# EAGLE design QuadLFO-Dev (EAGLE 9.2.1)

## Sheet 1 of 4: ATMEGA328P
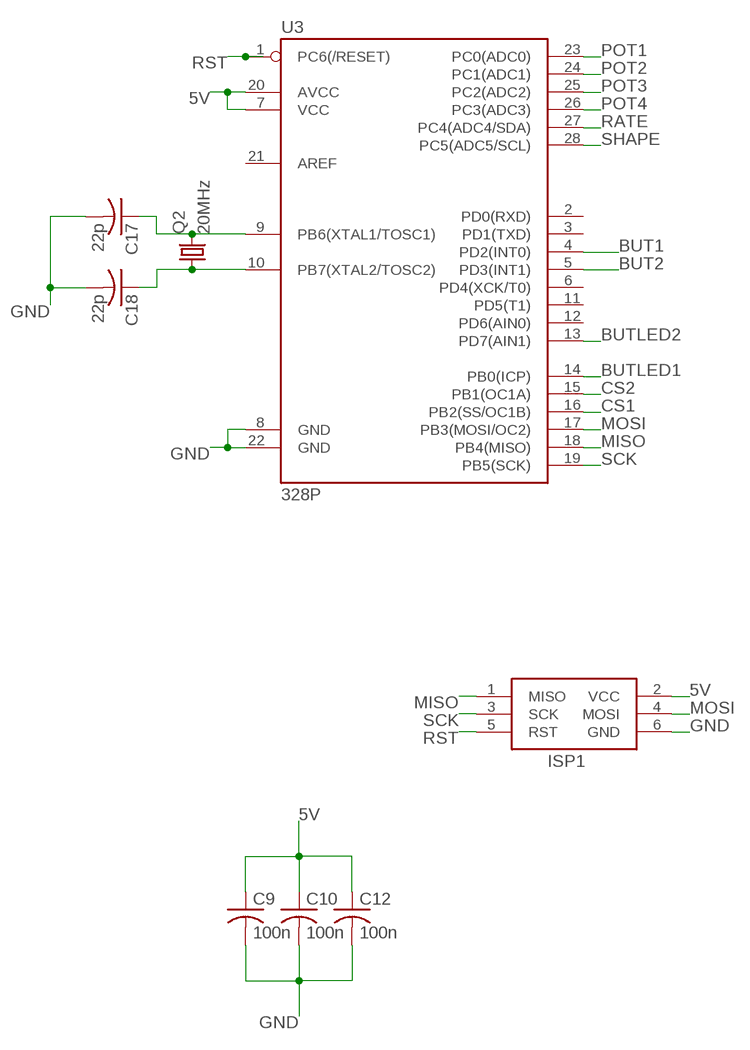
[diagram p0: schematic, sheet 1]

### Parts
C9  100n  C-USC0805K  [C0805K]
C10  100n  C-USC0805K  [C0805K]
C12  100n  C-USC0805K  [C0805K]
C17  22p  C-USC0805K  [C0805K]
C18  22p  C-USC0805K  [C0805K]
ISP1  AVRISP-6  [AVRISP]
Q2  20MHz  CRYSTALHC49UP  [HC49UP]
U3  328P  ATMEGA328P_PDIP  [DIP28]

### Nets
5V [Power]: C9.1 C10.1 C12.1 ISP1.2(VCC) U3.7(VCC) U3.20(AVCC) ; also sheet 2,3,4
BUT1: U3.4(PD2(INT0)) ; also sheet 4
BUT2: U3.5(PD3(INT1)) ; also sheet 4
BUTLED1: U3.14(PB0(ICP)) ; also sheet 4
BUTLED2: U3.13(PD7(AIN1)) ; also sheet 4
CS1: U3.16(PB2(SS/OC1B)) ; also sheet 3
CS2: U3.15(PB1(OC1A)) ; also sheet 3
GND [Power]: C9.2 C10.2 C12.2 C17.2 C18.2 ISP1.6(GND) U3.8(GND) U3.22(GND) ; also sheet 2,3,4
MISO: ISP1.1(MISO) U3.18(PB4(MISO))
MOSI: ISP1.4(MOSI) U3.17(PB3(MOSI/OC2)) ; also sheet 3
N$10: C17.1 Q2.2 U3.9(PB6(XTAL1/TOSC1))
N$11: C18.1 Q2.1 U3.10(PB7(XTAL2/TOSC2))
POT1: U3.23(PC0(ADC0)) ; also sheet 4
POT2: U3.24(PC1(ADC1)) ; also sheet 4
POT3: U3.25(PC2(ADC2)) ; also sheet 4
POT4: U3.26(PC3(ADC3)) ; also sheet 4
RATE: U3.27(PC4(ADC4/SDA)) ; also sheet 4
RST: ISP1.5(RST) U3.1(PC6(/RESET))
SCK: ISP1.3(SCK) U3.19(PB5(SCK)) ; also sheet 3
SHAPE: U3.28(PC5(ADC5/SCL)) ; also sheet 4
Unconnected: U3.2(PD0(RXD)) U3.3(PD1(TXD)) U3.6(PD4(XCK/T0)) U3.11(PD5(T1)) U3.12(PD6(AIN0)) U3.21(AREF)

## Sheet 2 of 4: Power
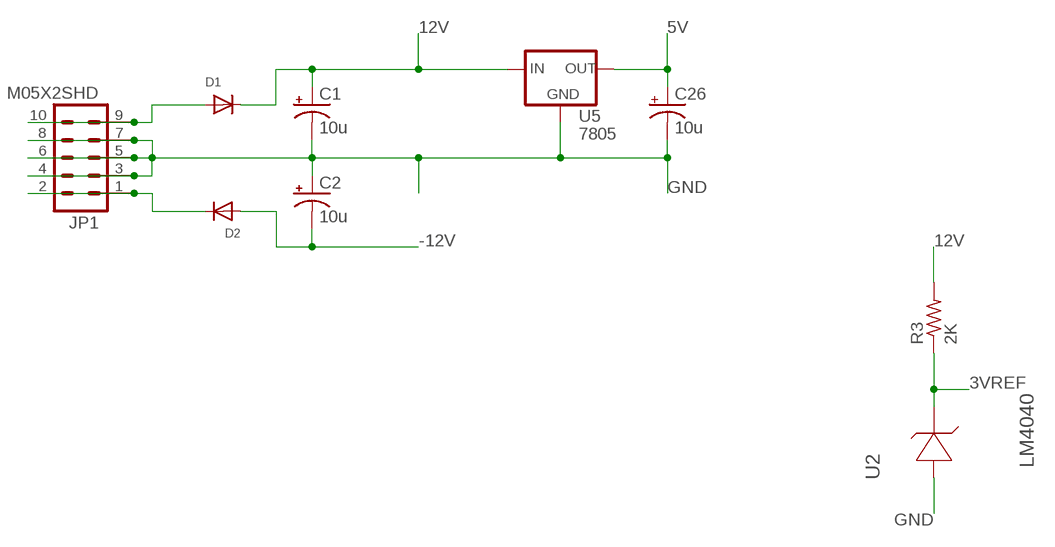
[diagram p1: schematic, sheet 2]

### Parts
C1  10u  CPOL-US153CLV-0505  [153CLV-0505]
C2  10u  CPOL-US153CLV-0505  [153CLV-0505]
C26  10u  CPOL-US153CLV-0505  [153CLV-0505]
D1  DIODESMA  [SMADIODE]
D2  DIODESMA  [SMADIODE]
JP1  M05X2SHD  [2X5-SHROUDED]
R3  2K  R-US_R0805  [R0805]
U2  LM4040  LM4040A30IDBZT  [SOT95P237X112-3N]
U5  7805  V-REG  [V-REG]

### Nets
3VREF: R3.1 U2.1(CATHODE) ; also sheet 3
5V [Power]: C26.+ U5.3(OUT) ; also sheet 1,3,4
12V: C1.+ D1.C R3.2 U5.1(IN) ; also sheet 3
-12V: C2.- D2.A ; also sheet 3
GND [Power]: C1.- C2.+ C26.- JP1.3 JP1.4 JP1.5 JP1.6 JP1.7 JP1.8 U2.2(ANODE) U5.4(GND) ; also sheet 1,3,4
N$2: D2.C JP1.1 JP1.2
N$9: D1.A JP1.9 JP1.10
Unconnected: U2.3(NC)

## Sheet 3 of 4: CV Out
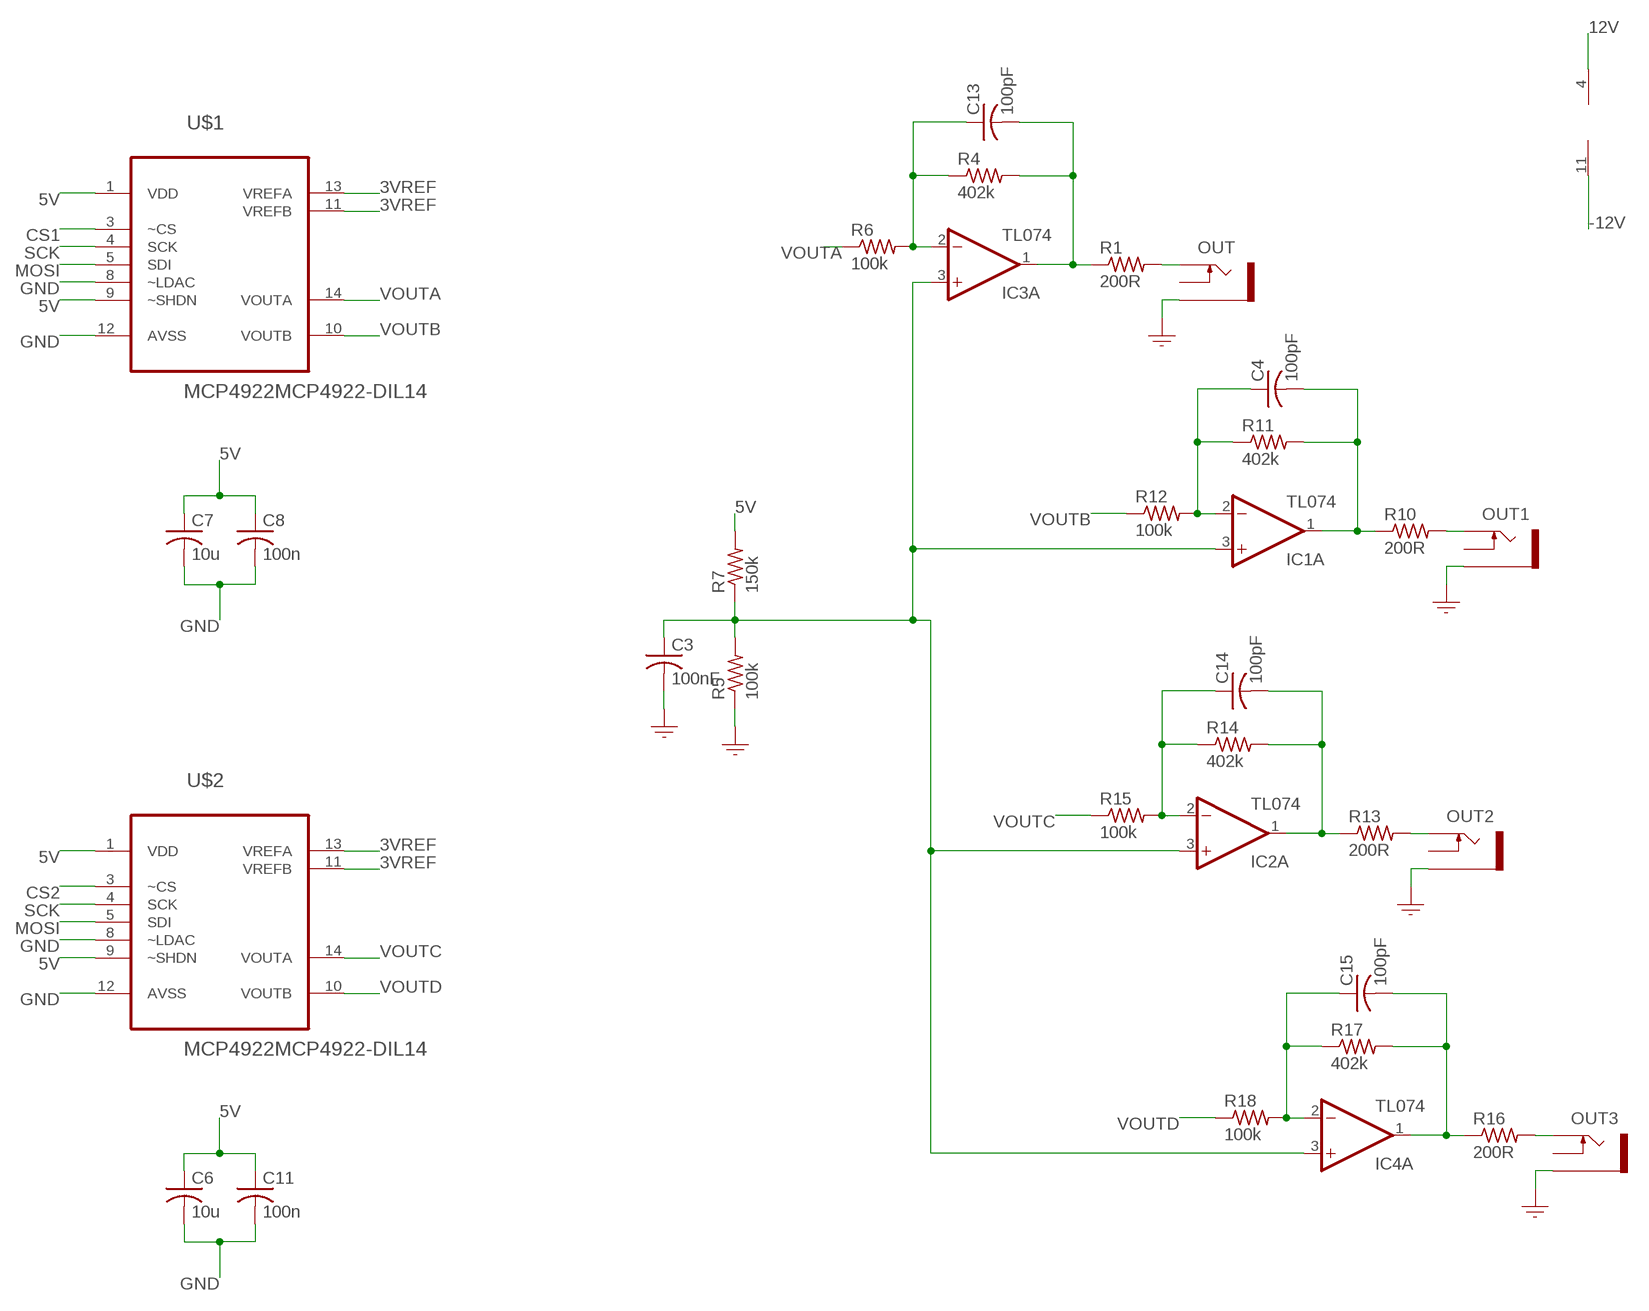
[diagram p2: schematic, sheet 3]

### Parts
C3  100nF  CAPACITOR-USC0805  [C0805]
C4  100pF  CAPACITOR-USC0805  [C0805]
C6  10u  C-USC0805K  [C0805K]
C7  10u  C-USC0805K  [C0805K]
C8  100n  C-USC0805K  [C0805K]
C11  100n  C-USC0805K  [C0805K]
C13  100pF  CAPACITOR-USC0805  [C0805]
C14  100pF  CAPACITOR-USC0805  [C0805]
C15  100pF  CAPACITOR-USC0805  [C0805]
IC1  TL074  OPAMP_QUADD  [SO14]
IC2  TL074  OPAMP_QUADD  [SO14]
IC3  TL074  OPAMP_QUADD  [SO14]
IC4  TL074  OPAMP_QUADD  [SO14]
OUT  PJ301M-12  SOCKET_MONO_3.5MMPJ301M-12  [PJ301M-12]
OUT1  PJ301M-12  SOCKET_MONO_3.5MMPJ301M-12  [PJ301M-12]
OUT2  PJ301M-12  SOCKET_MONO_3.5MMPJ301M-12  [PJ301M-12]
OUT3  PJ301M-12  SOCKET_MONO_3.5MMPJ301M-12  [PJ301M-12]
R1  200R  RESISTOR_USR0805  [R0805]
R4  402k  RESISTOR_USR0805  [R0805]
R5  100k  RESISTOR_USR0805  [R0805]
R6  100k  RESISTOR_USR0805  [R0805]
R7  150k  RESISTOR_USR0805  [R0805]
R10  200R  RESISTOR_USR0805  [R0805]
R11  402k  RESISTOR_USR0805  [R0805]
R12  100k  RESISTOR_USR0805  [R0805]
R13  200R  RESISTOR_USR0805  [R0805]
R14  402k  RESISTOR_USR0805  [R0805]
R15  100k  RESISTOR_USR0805  [R0805]
R16  200R  RESISTOR_USR0805  [R0805]
R17  402k  RESISTOR_USR0805  [R0805]
R18  100k  RESISTOR_USR0805  [R0805]
U$1  MCP4922MCP4922-DIL14  [DIL14]
U$2  MCP4922MCP4922-DIL14  [DIL14]

### Nets
3VREF: U$1.11(VREFB) U$1.13(VREFA) U$2.11(VREFB) U$2.13(VREFA) ; also sheet 2
5V [Power]: C6.1 C7.1 C8.1 C11.1 R7.2 U$1.1(VDD) U$1.9(~SHDN) U$2.1(VDD) U$2.9(~SHDN) ; also sheet 1,2,4
12V: IC1.4(P:V+) ; also sheet 2
-12V: IC1.11(P:V-) ; also sheet 2
CS1: U$1.3(~CS) ; also sheet 1
CS2: U$2.3(~CS) ; also sheet 1
GND [Power]: C3.2 C6.2 C7.2 C8.2 C11.2 OUT1.GND(SLEEVE) OUT2.GND(SLEEVE) OUT3.GND(SLEEVE) OUT.GND(SLEEVE) R5.1 U$1.8(~LDAC) U$1.12(AVSS) U$2.8(~LDAC) U$2.12(AVSS) ; also sheet 1,2,4
MOSI: U$1.5(SDI) U$2.5(SDI) ; also sheet 1
N$4: C13.2 IC3.1(A:OUT) R1.1 R4.2
N$5: OUT.TIP R1.2
N$12: C13.1 IC3.2(A:-IN) R4.1 R6.2
N$14: C4.2 IC1.1(A:OUT) R10.1 R11.2
N$15: OUT1.TIP R10.2
N$18: C4.1 IC1.2(A:-IN) R11.1 R12.2
N$19: C14.2 IC2.1(A:OUT) R13.1 R14.2
N$20: OUT2.TIP R13.2
N$23: C14.1 IC2.2(A:-IN) R14.1 R15.2
N$24: C15.2 IC4.1(A:OUT) R16.1 R17.2
N$26: OUT3.TIP R16.2
N$27: C3.1 IC1.3(A:+IN) IC2.3(A:+IN) IC3.3(A:+IN) IC4.3(A:+IN) R5.2 R7.1
N$29: C15.1 IC4.2(A:-IN) R17.1 R18.2
SCK: U$1.4(SCK) U$2.4(SCK) ; also sheet 1
VOUTA: R6.1 U$1.14(VOUTA)
VOUTB: R12.1 U$1.10(VOUTB)
VOUTC: R15.1 U$2.14(VOUTA)
VOUTD: R18.1 U$2.10(VOUTB)
Unconnected: IC1.5(B:+IN) IC1.6(B:-IN) IC1.7(B:OUT) IC1.8(C:OUT) IC1.9(C:-IN) IC1.10(C:+IN) IC1.12(D:+IN) IC1.13(D:-IN) IC1.14(D:OUT) IC2.5(B:+IN) IC2.6(B:-IN) IC2.7(B:OUT) IC2.8(C:OUT) IC2.9(C:-IN) IC2.10(C:+IN) IC2.12(D:+IN) IC2.13(D:-IN) IC2.14(D:OUT) IC3.5(B:+IN) IC3.6(B:-IN) IC3.7(B:OUT) IC3.8(C:OUT) IC3.9(C:-IN) IC3.10(C:+IN) IC3.12(D:+IN) IC3.13(D:-IN) IC3.14(D:OUT) IC4.5(B:+IN) IC4.6(B:-IN) IC4.7(B:OUT) IC4.8(C:OUT) IC4.9(C:-IN) IC4.10(C:+IN) IC4.12(D:+IN) IC4.13(D:-IN) IC4.14(D:OUT) OUT1.NORM(SWITCH) OUT2.NORM(SWITCH) OUT3.NORM(SWITCH) OUT.NORM(SWITCH)

## Sheet 4 of 4: Pots and Buttons
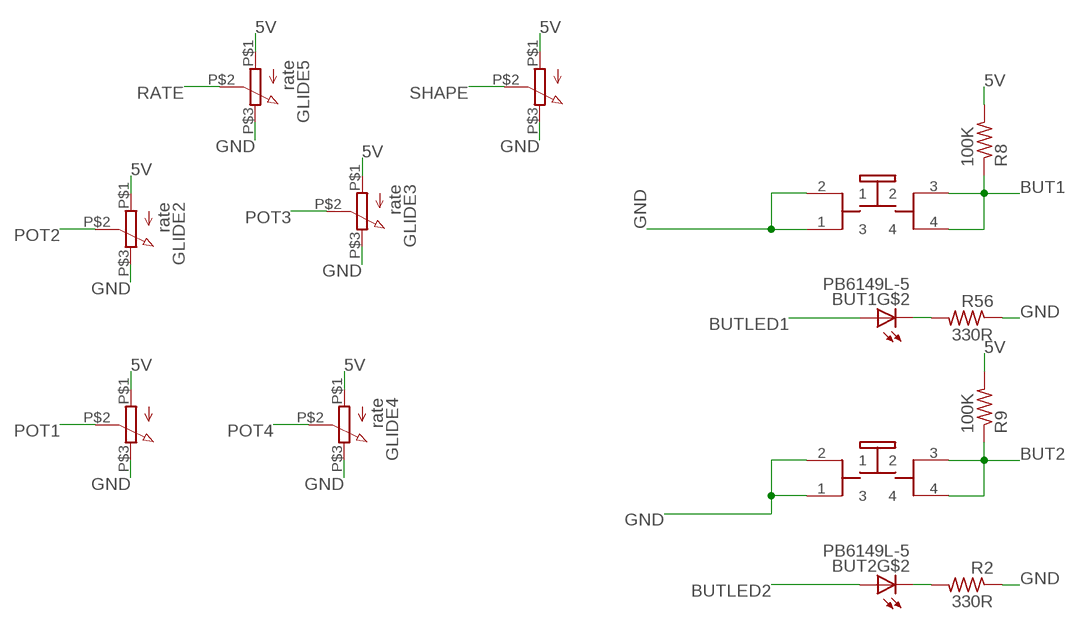
[diagram p3: schematic, sheet 4]

### Parts
BUT1  PB6149L-5  [PB6149L]
BUT2  PB6149L-5  [PB6149L]
GLIDE1  rate  9MMPOT  [POT]
GLIDE2  rate  9MMPOT  [POT]
GLIDE3  rate  9MMPOT  [POT]
GLIDE4  rate  9MMPOT  [POT]
GLIDE5  rate  9MMPOT  [POT]
GLIDE6  rate  9MMPOT  [POT]
R2  330R  R-US_R0805  [R0805]
R8  100K  R-US_R0805  [R0805]
R9  100K  R-US_R0805  [R0805]
R56  330R  R-US_R0805  [R0805]

### Nets
5V [Power]: GLIDE1.P$1 GLIDE2.P$1 GLIDE3.P$1 GLIDE4.P$1 GLIDE5.P$1 GLIDE6.P$1 R8.2 R9.2 ; also sheet 1,2,3
BUT1: BUT1.3 BUT1.4 R8.1 ; also sheet 1
BUT2: BUT2.3 BUT2.4 R9.1 ; also sheet 1
BUTLED1: BUT1.A ; also sheet 1
BUTLED2: BUT2.A ; also sheet 1
GND [Power]: BUT1.1 BUT1.2 BUT2.1 BUT2.2 GLIDE1.P$3 GLIDE2.P$3 GLIDE3.P$3 GLIDE4.P$3 GLIDE5.P$3 GLIDE6.P$3 R2.1 R56.1 ; also sheet 1,2,3
N$8: BUT2.K(C) R2.2
N$65: BUT1.K(C) R56.2
POT1: GLIDE1.P$2 ; also sheet 1
POT2: GLIDE2.P$2 ; also sheet 1
POT3: GLIDE3.P$2 ; also sheet 1
POT4: GLIDE4.P$2 ; also sheet 1
RATE: GLIDE5.P$2 ; also sheet 1
SHAPE: GLIDE6.P$2 ; also sheet 1

## Power pins joined to a net without a drawn wire
V+: IC2.4(P:V+) IC3.4(P:V+) IC4.4(P:V+)
V-: IC2.11(P:V-) IC3.11(P:V-) IC4.11(P:V-)

## Library data of the parts
BUT1 BUT2 = INSTRUO:PB6149L-5
C1 C2 C26 = rcl:CPOL-US: POLARIZED CAPACITOR, American symbol
C3 C4 C13-C15 = GMSN:CAPACITOR-US: Capacitor; SORT: 3
C6-C12 C17 C18 = rcl:C-US: CAPACITOR, American symbol
D1 D2 = adafruit:DIODE: Diode SMADIODE - SMA Surface Mount Package 20V 1A Schottky Diode Digikey: 641-1014-6-ND DO-1N4148 - Through Hole Small Current Diode SOD-123 20V 1 A (.5mV Vf) Schottky Diode - Digikey: MBRX120TPMSCT-ND SOD-323 10V 570mA (.38mV Vf, 3ns) Schottky Diode - Digikey: ZLLS410CT-ND SOD-523 30V 30mA Schottky Diode (RB751S-40TE61) - Digikey: RB751S-40TE61CT-ND SOT23-R/W - SOT23 Package (R = Solder Paste/Reflow Ovens, W = Hand-Soldering) BAT54Film 40V 300mA - Digikey: 497-7162-1-ND
GLIDE1-GLIDE6 = GMSN:9MMPOT
IC1-IC4 = GMSN:OPAMP_QUAD: OP AMP; SORT: 4
ISP1 = adafruit:AVRISP: AVR ISP HEADER Standard 6 pin header for AVR programming
JP1 = SparkFun-Connectors:M05X2: Header 5x2 Standard 10-pin dual row 0.1" header. Commonly used with AVR-ISP. Use with Spark Fun Electronics SKU: PRT-00778
OUT OUT1-OUT3 = GMSN:SOCKET_MONO_3.5MM: 3.5 mm Jack Socket; SORT: 8
Q2 = adafruit:CRYSTAL: CRYSTAL; OC_FARNELL: unknown; OC_NEWARK: unknown
R1 R4-R7 R10-R18 = GMSN:RESISTOR_US: Resistor; SORT: 2
R2 R3 R8 R9 R56 = rcl:R-US_: RESISTOR, American symbol
U2 = GMSN-R2Project:LM4040A30IDBZT: PRECISION MICROPOWER SHUNT VOLTAGE REFERENCE; MPN: LM4040A50IDBZT; OC_FARNELL: 1755108; OC_NEWARK: 58K5870; PACKAGE: 3-SOT-23; RS-NUMBER: 809-6352; SUPPLIER: TEXAS INSTRUMENTS
U3 = SparkFun-IC-Microcontroller:ATMEGA328P_PDIP: Atmel 328P Through hole ATMEGA328P uC used in the Arduino 32kb flash, 1k EEPROM, 2k SRAM Datasheet <http://www.sparkfun.com/datasheets/Components/SMD/ATMega328.pdf> SparkFun Products Storefront component: AVR 28 Pin 20MHz 32K 6A/D - ATMega328P <https://www.sparkfun.com/products/9061> (COM-09061) SparkFun Simon Says - Through-Hole Soldering Kit <https://www.sparkfun.com/products/10547> (KIT-10547) SparkFun Learn to Solder - Simon Says <https://www.sparkfun.com/products/13708> (KIT-13708) SparkFun BigTime Watch Kit <https://www.sparkfun.com/products/11734> (KIT-11734) SparkFun ClockIt <https://www.sparkfun.com/products/10930> (KIT-10930) SparkFun Serial Enabled LCD Kit <https://www.sparkfun.com/products/10097> (LCD-10097) SparkFun Simon Tilts - Through Hole Soldering Kit <https://www.sparkfun.com/products/12634> (KIT-12634) SparkFun Frequency Counter Kit <https://www.sparkfun.com/products/10140> (KIT-10140) FabFM Radio Kit <https://www.sparkfun.com/products/11043> (KIT-11043) SparkFun Binary Blaster Kit <https://www.sparkfun.com/products/12037> (KIT-12037) SparkFun Metro-Gnome <https://www.sparkfun.com/products/9236> (KIT-09236) ATmega328 with Arduino Optiboot (Uno) <https://www.sparkfun.com/products/10524> (DEV-10524); PROD_ID: IC-09136
U5 = INSTRUO:V-REG
U$1 U$2 = GMSN-R2Project:MCP4922

## Net classes
1 Power: width 0.8 mm

## Board
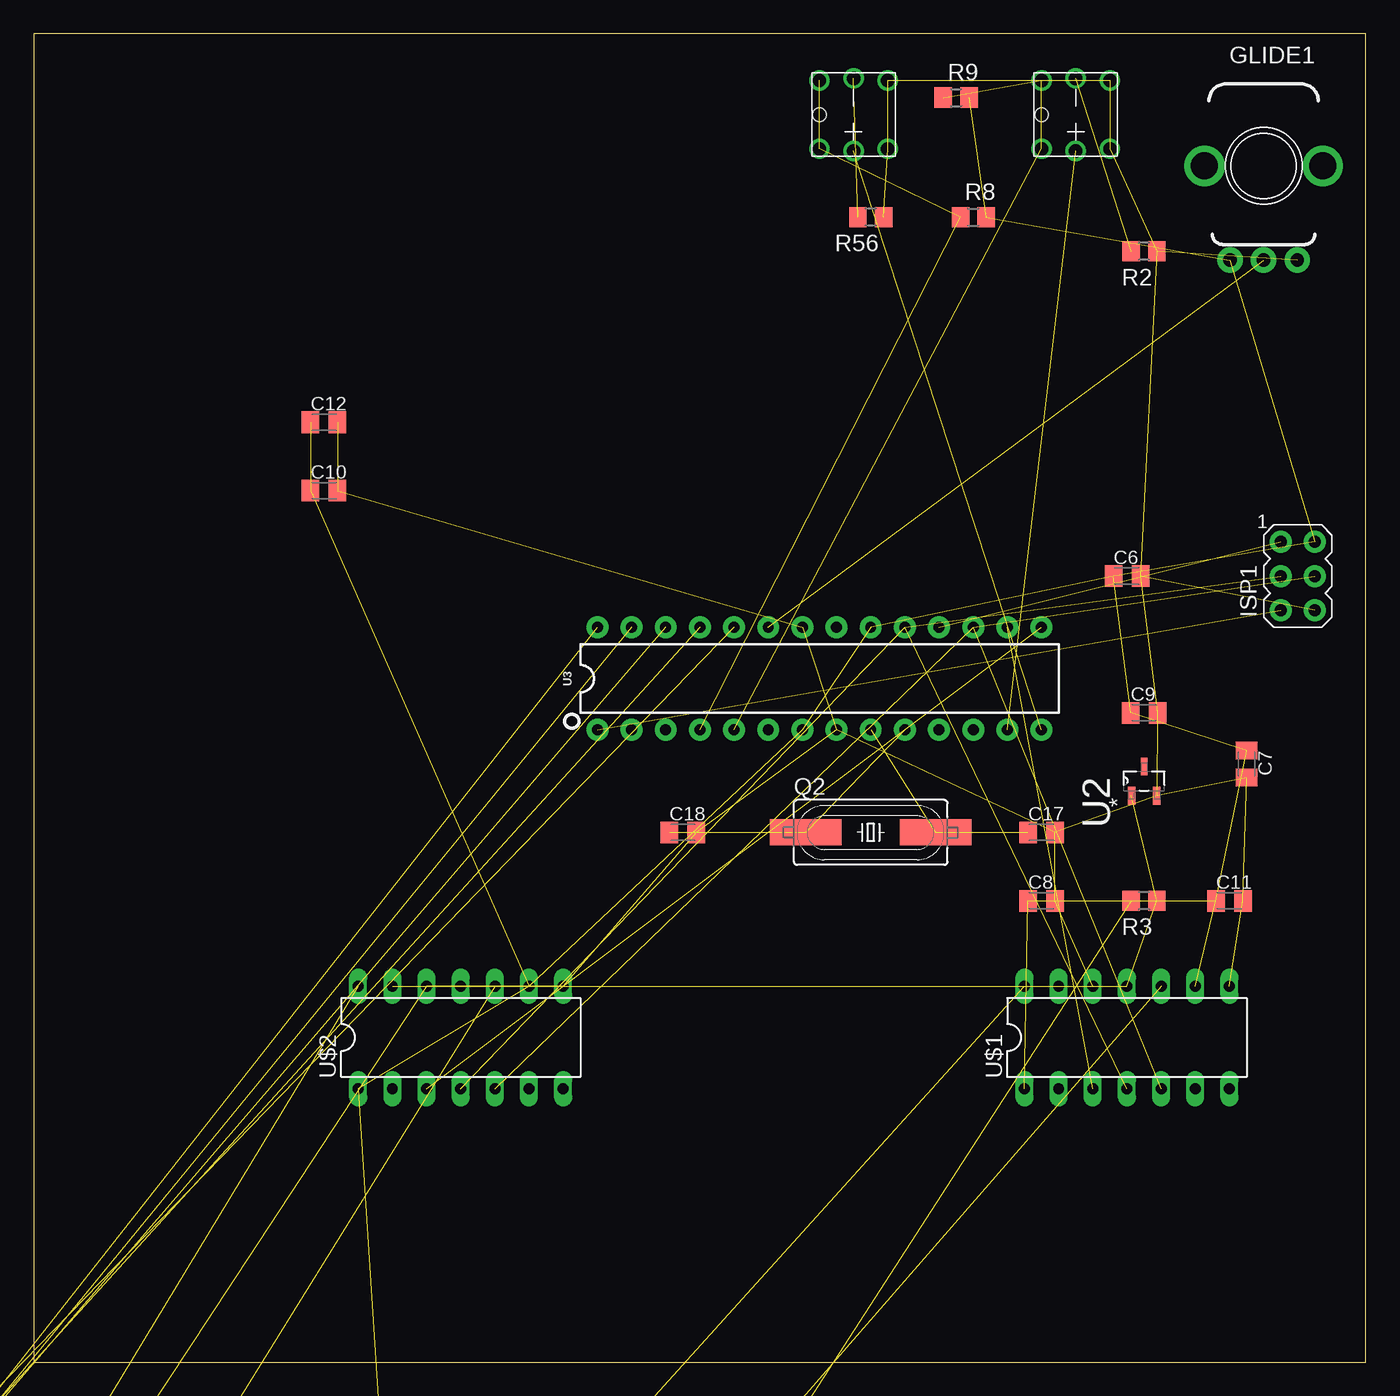
[diagram p4: board, top side]
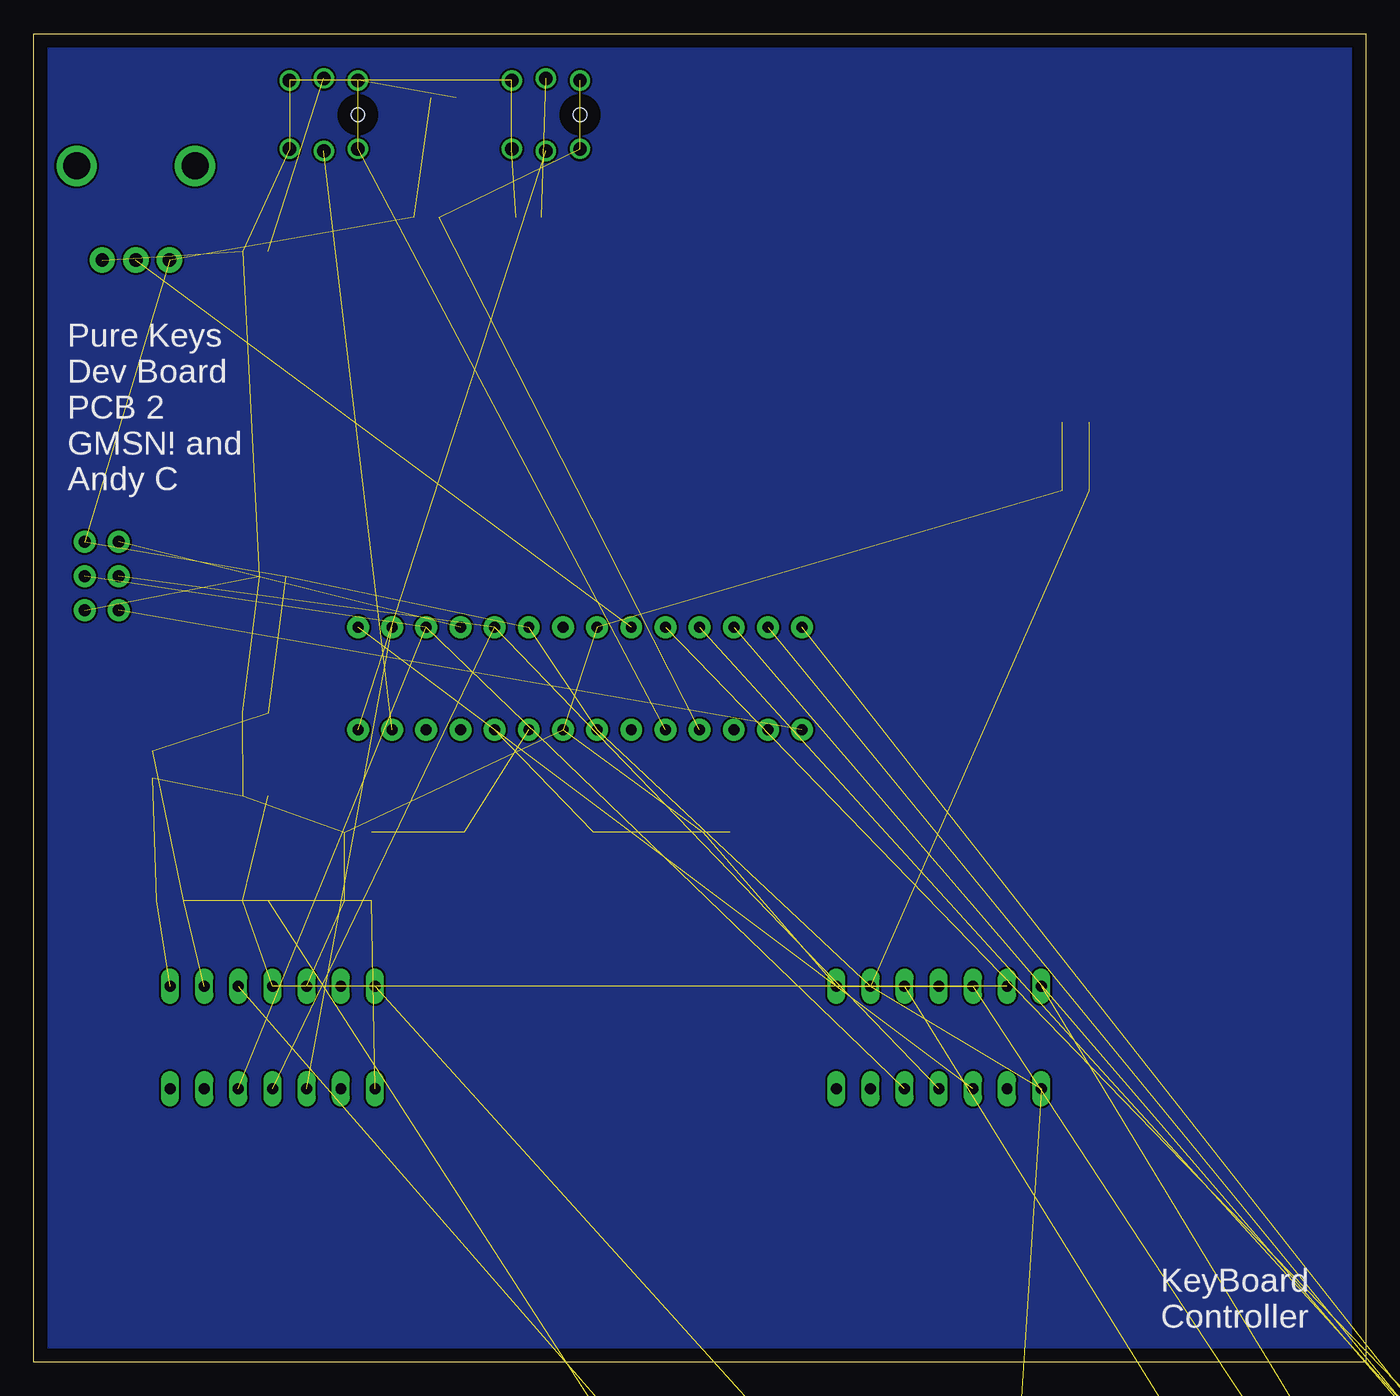
[diagram p5: board, bottom side, seen from below]

Size 99.04 x 98.73 mm. Coordinates in mm from the lower left corner, seen from the top.
Outline: 0,0 99.04,0 99.04,98.73 0,98.73 0,0
Copper layers (1*16): Top 0.035mm / dielectric 1.5mm / Bottom 0.035mm
Design rules "default": minimum track width 6mil, minimum drill 0.35mm, track to track 6mil, track to pad 6mil, pad to pad 6mil, via to via 6mil, smd to smd 6mil, copper to edge 40mil, drill to drill 6mil, minimum pad ring 10mil, minimum via ring 8mil, stop-mask expansion 4mil, vias tented up to drill 0mil, thermal gap 10mil

### Footprints (pad centres in the part's own frame; a part is rotated, then mirrored left to right if it is on the bottom)
PB6149L = drill 1: 1 2.54,-2.54; 2 2.54,2.54; 3 -2.54,-2.54; 4 -2.54,2.54; A 0,-2.7; K 0,2.7 | hole 1: -2.54,0
153CLV-0505 = smd 3 x 1.6: + 2.2,0; - -2.2,0
C0805 = smd 1.3 x 1.5: 1 -0.95,0; 2 0.95,0
C0805K = smd 1.3 x 1.6: 1 -1,0; 2 1,0
SMADIODE = smd 2.54 x 2.54: A 2.349,0; C -2.349,0
POT = drill 1 pad 1.88: P$1 -2.5,-7; P$2 0,-7; P$3 2.5,-7 | drill 2 pad 2.68: P$4 -4.4,0; P$5 4.4,0
SO14 = smd 0.6 x 2.2: 1 -3.81,-2.6; 2 -2.54,-2.6; 3 -1.27,-2.6; 4 0,-2.6; 5 1.27,-2.6; 6 2.54,-2.6; 7 3.81,-2.6; 8 3.81,2.6; 9 2.54,2.6; 10 1.27,2.6; 11 0,2.6; 12 -1.27,2.6; 13 -2.54,2.6; 14 -3.81,2.6
AVRISP = drill 0.9 pad 1.626: 1 -1.27,2.54; 2 1.27,2.54; 3 -1.27,0; 4 1.27,0; 5 -1.27,-2.54; 6 1.27,-2.54
2X5-SHROUDED = drill 1.016 pad 1.88 octagon: 1 -1.27,5.08; 2 1.27,5.08; 3 -1.27,2.54; 4 1.27,2.54; 5 -1.27,0; 6 1.27,0; 7 -1.27,-2.54; 8 1.27,-2.54; 9 -1.27,-5.08; 10 1.27,-5.08
PJ301M-12 = drill 1.1: GND 0,-6.5; NORM 0,-3.5; TIP 0,5 | hole 1.778: 0,0
HC49UP = smd 5.334 x 1.93: 1 -4.826,0; 2 4.826,0
R0805 = smd 1.3 x 1.5: 1 -0.95,0; 2 0.95,0
SOT95P237X112-3N = smd 1.321 x 0.559: 1 -1.092,0.94; 2 -1.092,-0.94 | smd 1.321 x 0.508: 3 1.092,0
DIP28 = drill 0.813 pad 1.626: 1 -16.51,-3.81; 2 -13.97,-3.81; 3 -11.43,-3.81; 4 -8.89,-3.81; 5 -6.35,-3.81; 6 -3.81,-3.81; 7 -1.27,-3.81; 8 1.27,-3.81; 9 3.81,-3.81; 10 6.35,-3.81; 11 8.89,-3.81; 12 11.43,-3.81; 13 13.97,-3.81; 14 16.51,-3.81; 15 16.51,3.81; 16 13.97,3.81; 17 11.43,3.81; 18 8.89,3.81; 19 6.35,3.81; 20 3.81,3.81; 21 1.27,3.81; 22 -1.27,3.81; 23 -3.81,3.81; 24 -6.35,3.81; 25 -8.89,3.81; 26 -11.43,3.81; 27 -13.97,3.81; 28 -16.51,3.81
V-REG = smd 1.6 x 3: 1 -2.28,-4.8; 3 2.28,-4.8 | smd 5.8 x 6.2: 4 0,2.38
DIL14 = drill 0.813 long: 1 -7.62,-3.81; 2 -5.08,-3.81; 3 -2.54,-3.81; 4 0,-3.81; 5 2.54,-3.81; 6 5.08,-3.81; 7 7.62,-3.81; 8 7.62,3.81; 9 5.08,3.81; 10 2.54,3.81; 11 0,3.81; 12 -2.54,3.81; 13 -5.08,3.81; 14 -7.62,3.81

### Placement (x,y rotation side)
BUT1  60.96,92.71 0 top
BUT2  77.47,92.71 0 top
C1  1.27,-66.04 0 top  (outside the outline)
C2  8.89,-66.04 0 top  (outside the outline)
C3  -138.43,-201.93 0 top  (outside the outline)
C4  -138.43,-241.3 0 top  (outside the outline)
C6  81.28,58.42 0 top
C7  90.17,44.45 270 top
C8  74.93,34.29 0 top
C9  82.55,48.26 0 top
C10  21.59,64.77 0 top
C11  88.9,34.29 0 top
C12  21.59,69.85 0 top
C13  -125.73,-189.23 0 top  (outside the outline)
C14  -148.59,-269.24 0 top  (outside the outline)
C15  -160.02,-297.18 0 top  (outside the outline)
C17  74.93,39.37 0 top
C18  48.26,39.37 0 top
C26  16.51,-66.04 0 top  (outside the outline)
D1  25.4,-63.5 0 top  (outside the outline)
D2  34.29,-63.5 0 top  (outside the outline)
GLIDE1  91.44,88.9 0 top
GLIDE2  -83.82,-78.74 0 top  (outside the outline)
GLIDE3  -93.98,-96.52 0 top  (outside the outline)
GLIDE4  -104.14,-114.3 0 top  (outside the outline)
GLIDE5  -114.3,-132.08 0 top  (outside the outline)
GLIDE6  -124.46,-149.86 0 top  (outside the outline)
IC1  -146.05,-233.68 0 top  (outside the outline)
IC2  -157.48,-261.62 0 top  (outside the outline)
IC3  -134.62,-189.23 0 top  (outside the outline)
IC4  -168.91,-289.56 0 top  (outside the outline)
ISP1  93.98,58.42 0 top
JP1  1.27,-15.24 0 top  (outside the outline)
OUT  -134.62,-165.1 0 top  (outside the outline)
OUT1  -146.05,-222.25 0 top  (outside the outline)
OUT2  -157.48,-250.19 0 top  (outside the outline)
OUT3  -168.91,-278.13 0 top  (outside the outline)
Q2  62.23,39.37 0 top
R1  -120.65,-189.23 0 top  (outside the outline)
R2  82.55,82.55 180 top
R3  82.55,34.29 180 top
R4  -138.43,-196.85 0 top  (outside the outline)
R5  -133.35,-196.85 0 top  (outside the outline)
R6  -128.27,-196.85 0 top  (outside the outline)
R7  -123.19,-196.85 0 top  (outside the outline)
R8  69.85,85.09 0 top
R9  68.58,93.98 0 top
R10  -137.16,-233.68 0 top  (outside the outline)
R11  -143.51,-241.3 0 top  (outside the outline)
R12  -149.86,-241.3 0 top  (outside the outline)
R13  -148.59,-261.62 0 top  (outside the outline)
R14  -161.29,-269.24 0 top  (outside the outline)
R15  -154.94,-269.24 0 top  (outside the outline)
R16  -160.02,-289.56 0 top  (outside the outline)
R17  -172.72,-297.18 0 top  (outside the outline)
R18  -166.37,-297.18 0 top  (outside the outline)
R56  62.23,85.09 180 top
U2  82.55,43.18 90 top
U3  58.42,50.8 0 top
U5  26.67,-49.53 0 top  (outside the outline)
U$1  81.28,24.13 0 top
U$2  31.75,24.13 0 top

### Tracks (layer width: path | path; a pad name or v marks a point on that pad's centre or on a via)
3VREF  (5 unrouted)
5V  (24 unrouted)
12V  (4 unrouted)
-12V  (2 unrouted)
BUT1  (3 unrouted)
BUT2  (3 unrouted)
BUTLED1  (1 unrouted)
BUTLED2  (1 unrouted)
CS1  (1 unrouted)
CS2  (1 unrouted)
GND  (44 unrouted)
MISO  (1 unrouted)
MOSI  (3 unrouted)
N$1
  pour Bottom: 0,99.06 99.06,99.06 99.06,0 0,0
N$2  (2 unrouted)
N$4  (3 unrouted)
N$5  (1 unrouted)
N$8  (1 unrouted)
N$9  (2 unrouted)
N$10  (2 unrouted)
N$11  (2 unrouted)
N$12  (3 unrouted)
N$14  (3 unrouted)
N$15  (1 unrouted)
N$18  (3 unrouted)
N$19  (3 unrouted)
N$20  (1 unrouted)
N$23  (3 unrouted)
N$24  (3 unrouted)
N$26  (1 unrouted)
N$27  (6 unrouted)
N$29  (3 unrouted)
N$65  (1 unrouted)
POT1  (1 unrouted)
POT2  (1 unrouted)
POT3  (1 unrouted)
POT4  (1 unrouted)
RATE  (1 unrouted)
RST  (1 unrouted)
SCK  (3 unrouted)
SHAPE  (1 unrouted)
V+  (2 unrouted)
V-  (2 unrouted)
VOUTA  (1 unrouted)
VOUTB  (1 unrouted)
VOUTC  (1 unrouted)
VOUTD  (1 unrouted)

### Text on the board
bNames: Pure Keys / Dev Board / PCB 2 / GMSN! and / Andy C | KeyBoard / Controller